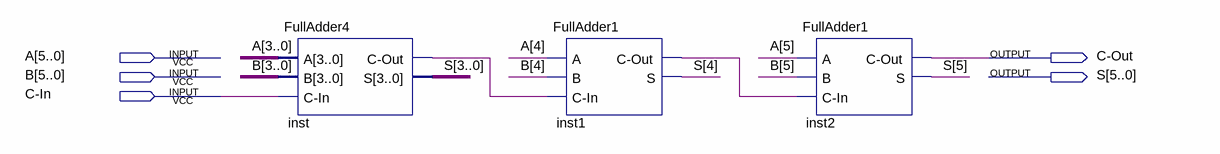
[diagram p0: schematic sheet]
// Quartus schematic FullAdder6.bdf as structural Verilog: 3 symbols, 5 pins
module FullAdder6 (
  input  [5:0] A,
  input  [5:0] B,
  input  \C-In ,
  output \C-Out ,
  output [5:0] S
);

  wire inst1_c_out, inst_c_out;

  FullAdder4 inst (.A(A[3:0]), .B(B[3:0]), .\C-In (\C-In ), .\C-Out (inst_c_out), .S(S[3:0]));
  FullAdder1 inst1 (.A(A[4]), .B(B[4]), .\C-In (inst_c_out), .\C-Out (inst1_c_out), .S(S[4]));
  FullAdder1 inst2 (.A(A[5]), .B(B[5]), .\C-In (inst1_c_out), .\C-Out (\C-Out ), .S(S[5]));
endmodule
